# EAGLE schematic brick_i2c_rtc (EAGLE 7.3.0)
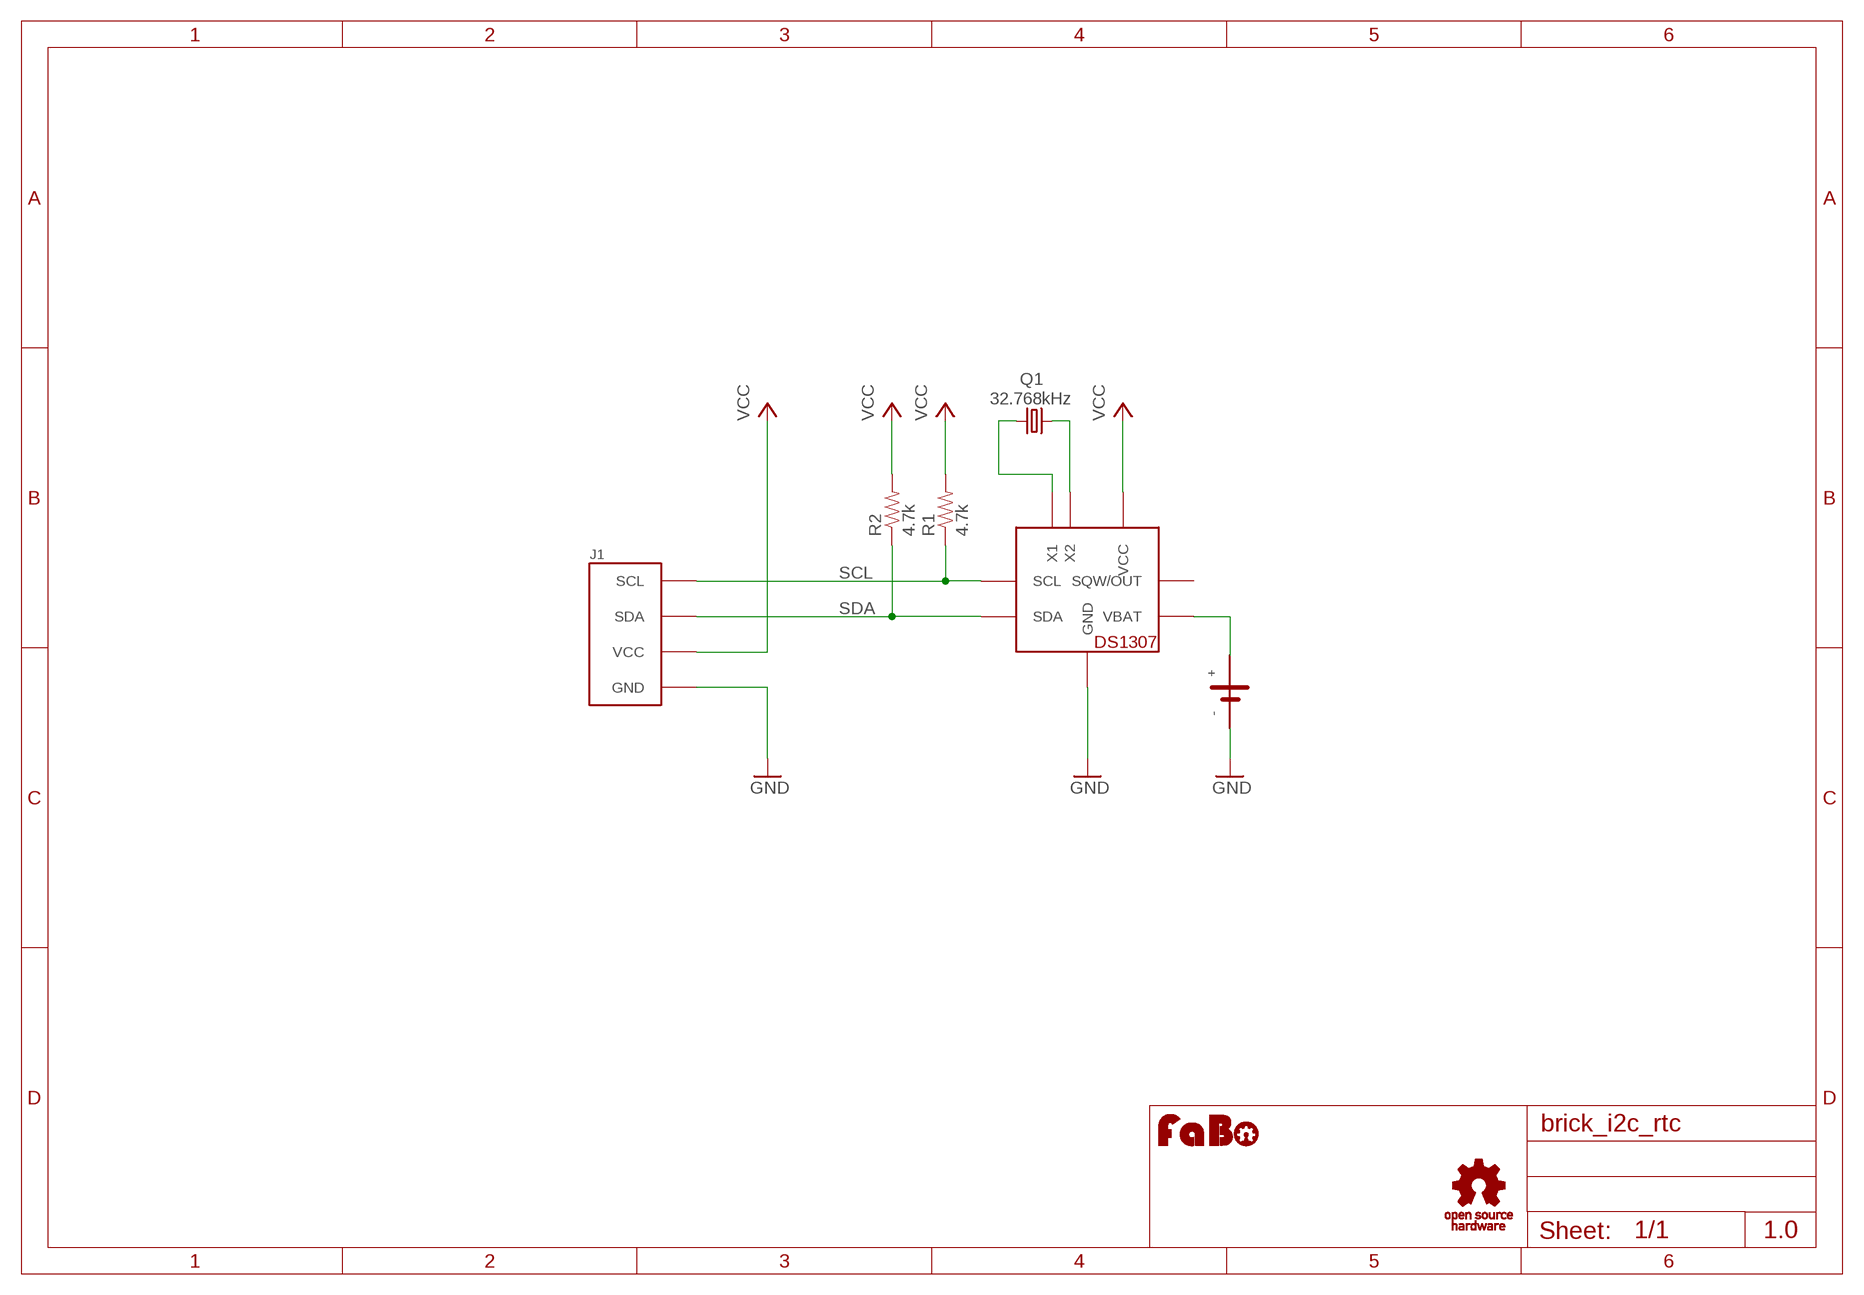
[diagram p0: schematic, sheet 1]

## Parts
J1  BRICK_I2C  [BRICK_I2C]
Q1  32.768kHz  FC-255  [FC-255]
R1  4.7k  RES-EIA0603  [EIA0603]
R2  4.7k  RES-EIA0603  [EIA0603]
U1  RTC-DS1307  [RTC-DS130]
U$2  CH7410-2032LF  [CH7401-2032LF]
U$3  LOGO_OSHW_T-M  [LOGO_OSHW_T_M]
U$4  LOGO_FABO-M  [LOGO_FABO_M]

## Nets
GND: J1.GND U1.GND U$2.1
N$1: U1.VBAT U$2.0
N$3: Q1.1 U1.X1
N$4: Q1.2 U1.X2
SCL: J1.SCL R1.1 U1.SCL
SDA: J1.SDA R2.1 U1.SDA
VCC: J1.VCC R1.2 R2.2 U1.VCC
Unconnected: U1.SQW/OUT

## Notes on the sheet
- 1.0

## Library data of the parts
J1 = gclue:BRICK_I2C: FaBo Brick 4pin(I2C)
Q1 = gclue:FC-255: FC-255 CRYSTAL Unit SMD 32.768kHz akizuki http://akizukidenshi.com/catalog/g/gP-03004/
R1 R2 = gclue:RES
U1 = gclue:RTC-DS1307: RTC DS1307 SMD
U$2 = gclue:CH7410-2032LF: 2032 Battery Holder
U$3 = gclue:LOGO_OSHW_T
U$4 = FaBo:LOGO_FABO

## Net classes
0 default: width 0.305 mm